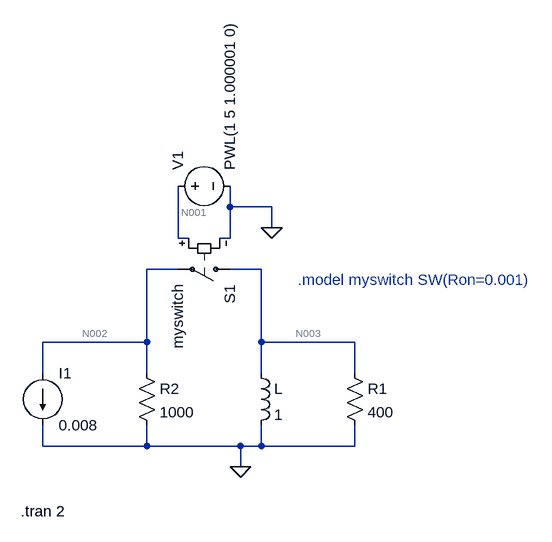
[diagram p0: schematic Draft1.asc]
Draft1.asc, the LTspice schematic file:
Version 4
SHEET 1 880 680
WIRE 208 -112 208 -144
WIRE 272 -112 208 -112
WIRE 272 -80 272 -112
WIRE 128 -64 128 -144
WIRE 144 -64 128 -64
WIRE 208 -64 208 -112
WIRE 208 -64 192 -64
WIRE 128 -16 80 -16
WIRE 256 -16 208 -16
WIRE 80 96 80 -16
WIRE 80 96 -80 96
WIRE 256 96 256 -16
WIRE 400 96 256 96
WIRE -80 144 -80 96
WIRE 80 144 80 96
WIRE 256 144 256 96
WIRE 400 144 400 96
WIRE -80 256 -80 224
WIRE 80 256 80 224
WIRE 80 256 -80 256
WIRE 224 256 80 256
WIRE 256 256 256 224
WIRE 256 256 224 256
WIRE 400 256 400 224
WIRE 400 256 256 256
WIRE 224 288 224 256
FLAG 224 288 0
FLAG 272 -80 0
SYMBOL ind 240 128 R0
SYMATTR InstName L
SYMATTR Value 1
SYMBOL res 384 128 R0
SYMATTR InstName R1
SYMATTR Value 400
SYMBOL res 64 128 R0
SYMATTR InstName R2
SYMATTR Value 1000
SYMBOL current -80 144 R0
WINDOW 123 0 0 Left 0
WINDOW 39 0 0 Left 0
SYMATTR InstName I1
SYMATTR Value 0.008
SYMBOL sw 224 -16 R90
SYMATTR InstName S1
SYMATTR Value myswitch
SYMBOL voltage 112 -144 R270
WINDOW 123 0 0 Left 0
WINDOW 39 0 0 Left 0
SYMATTR InstName V1
SYMATTR Value PWL(1 5 1.000001 0)
TEXT -114 356 Left 2 !.tran 2
TEXT 312 0 Left 2 ;.model myswitch SW(Ron=0.001)

The netlist it stands for:
* Draft1.asc
L N003 0 1
R1 N003 0 400
R2 N002 0 1000
I1 N002 0 0.008
S1 N003 N002 N001 0 myswitch
V1 N001 0 PWL(1 5 1.000001 0)
.tran 2
* .model myswitch SW(Ron=0.001)
.backanno
.end

* Results of the author's LTspice run, read from the files saved beside the schematic
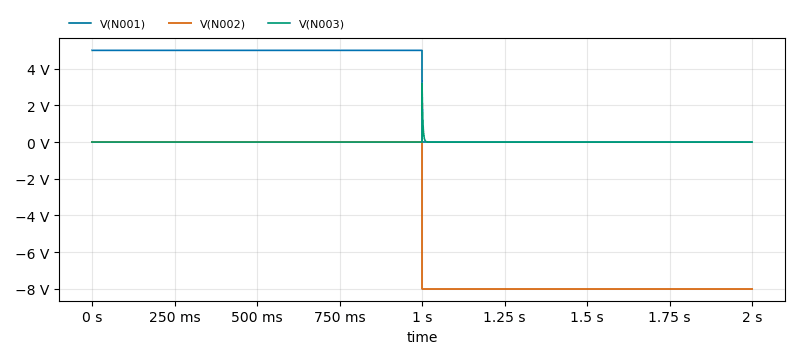
[diagram p1: Transient Analysis of Draft1.asc, plotted from the saved traces]
* Transient Analysis, 1 run:
*   V(N001): min 0 V, max 5 V, average 2.5 V, rms 3.536 V, last 0 V
*   V(N002): min -8 V, max -8 mV, average -4.004 V, rms 5.657 V, last -8 V
*   V(N003): min -7.992 µV, max 3.197 V, average 3.992 mV, rms 79.92 mV, last 0 V